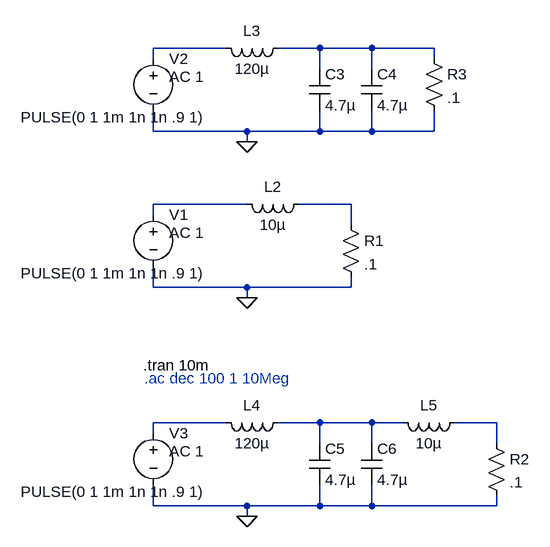
[diagram p0: schematic test.asc]
test.asc, the LTspice schematic file:
Version 4
SHEET 1 904 680
WIRE 96 -128 -16 -128
WIRE 240 -128 176 -128
WIRE 320 -128 240 -128
WIRE 416 -128 320 -128
WIRE -16 -112 -16 -128
WIRE 416 -112 416 -128
WIRE 240 -96 240 -128
WIRE 320 -96 320 -128
WIRE -16 0 -16 -32
WIRE 128 0 -16 0
WIRE 240 0 240 -32
WIRE 240 0 128 0
WIRE 320 0 320 -32
WIRE 320 0 240 0
WIRE 416 0 416 -32
WIRE 416 0 320 0
WIRE 128 16 128 0
WIRE 128 112 -16 112
WIRE 288 112 208 112
WIRE -16 128 -16 112
WIRE 288 144 288 112
WIRE -16 240 -16 208
WIRE 128 240 -16 240
WIRE 288 240 288 224
WIRE 288 240 128 240
WIRE 128 256 128 240
WIRE 96 448 -16 448
WIRE 240 448 176 448
WIRE 320 448 240 448
WIRE 368 448 320 448
WIRE 512 448 448 448
WIRE -16 464 -16 448
WIRE 240 480 240 448
WIRE 320 480 320 448
WIRE 512 480 512 448
WIRE -16 576 -16 544
WIRE 128 576 -16 576
WIRE 240 576 240 544
WIRE 240 576 128 576
WIRE 320 576 320 544
WIRE 320 576 240 576
WIRE 512 576 512 560
WIRE 512 576 320 576
WIRE 128 592 128 576
FLAG 128 16 0
FLAG 128 592 0
FLAG 128 256 0
SYMBOL voltage -16 112 R0
WINDOW 3 -204 106 Left 2
WINDOW 123 24 44 Left 2
WINDOW 39 0 0 Left 0
SYMATTR Value PULSE(0 1 1m 1n 1n .9 1)
SYMATTR Value2 AC 1
SYMATTR InstName V1
SYMBOL res 272 128 R0
SYMATTR InstName R1
SYMATTR Value .1
SYMBOL ind 224 96 R90
WINDOW 0 5 56 VBottom 2
WINDOW 3 32 56 VTop 2
SYMATTR InstName L2
SYMATTR Value 10µ
SYMATTR SpiceLine Rser=5m
SYMBOL voltage -16 -128 R0
WINDOW 3 -204 106 Left 2
WINDOW 123 24 44 Left 2
WINDOW 39 0 0 Left 0
SYMATTR Value PULSE(0 1 1m 1n 1n .9 1)
SYMATTR Value2 AC 1
SYMATTR InstName V2
SYMBOL ind 192 -144 R90
WINDOW 0 5 56 VBottom 2
WINDOW 3 32 56 VTop 2
SYMATTR InstName L3
SYMATTR Value 120µ
SYMATTR SpiceLine Rser=28m
SYMBOL cap 224 -96 R0
SYMATTR InstName C3
SYMATTR Value 4.7µ
SYMATTR SpiceLine Rser=.9
SYMBOL cap 304 -96 R0
SYMATTR InstName C4
SYMATTR Value 4.7µ
SYMATTR SpiceLine Rser=.9
SYMBOL voltage -16 448 R0
WINDOW 3 -204 106 Left 2
WINDOW 123 24 44 Left 2
WINDOW 39 0 0 Left 0
SYMATTR Value PULSE(0 1 1m 1n 1n .9 1)
SYMATTR Value2 AC 1
SYMATTR InstName V3
SYMBOL ind 192 432 R90
WINDOW 0 5 56 VBottom 2
WINDOW 3 32 56 VTop 2
SYMATTR InstName L4
SYMATTR Value 120µ
SYMATTR SpiceLine Rser=28m
SYMBOL cap 224 480 R0
SYMATTR InstName C5
SYMATTR Value 4.7µ
SYMATTR SpiceLine Rser=.9
SYMBOL cap 304 480 R0
SYMATTR InstName C6
SYMATTR Value 4.7µ
SYMATTR SpiceLine Rser=.9
SYMBOL res 496 464 R0
SYMATTR InstName R2
SYMATTR Value .1
SYMBOL ind 464 432 R90
WINDOW 0 5 56 VBottom 2
WINDOW 3 32 56 VTop 2
SYMATTR InstName L5
SYMATTR Value 10µ
SYMATTR SpiceLine Rser=5m
SYMBOL res 400 -128 R0
SYMATTR InstName R3
SYMATTR Value .1
TEXT -32 360 Left 2 !.tran 10m
TEXT -30 380 Left 2 ;.ac dec 100 1 10Meg

The netlist it stands for:
* test.asc
V1 N003 0 PULSE(0 1 1m 1n 1n .9 1) AC 1
R1 N004 0 .1
L2 N004 N003 10µ Rser=5m
V2 N001 0 PULSE(0 1 1m 1n 1n .9 1) AC 1
L3 N002 N001 120µ Rser=28m
C3 N002 0 4.7µ Rser=.9
C4 N002 0 4.7µ Rser=.9
V3 N005 0 PULSE(0 1 1m 1n 1n .9 1) AC 1
L4 N006 N005 120µ Rser=28m
C5 N006 0 4.7µ Rser=.9
C6 N006 0 4.7µ Rser=.9
R2 N007 0 .1
L5 N007 N006 10µ Rser=5m
R3 N002 0 .1
.tran 10m
* .ac dec 100 1 10Meg
.backanno
.end